# Altium schematic sheet TMC2160.SchDoc
size 381 x 241 mm
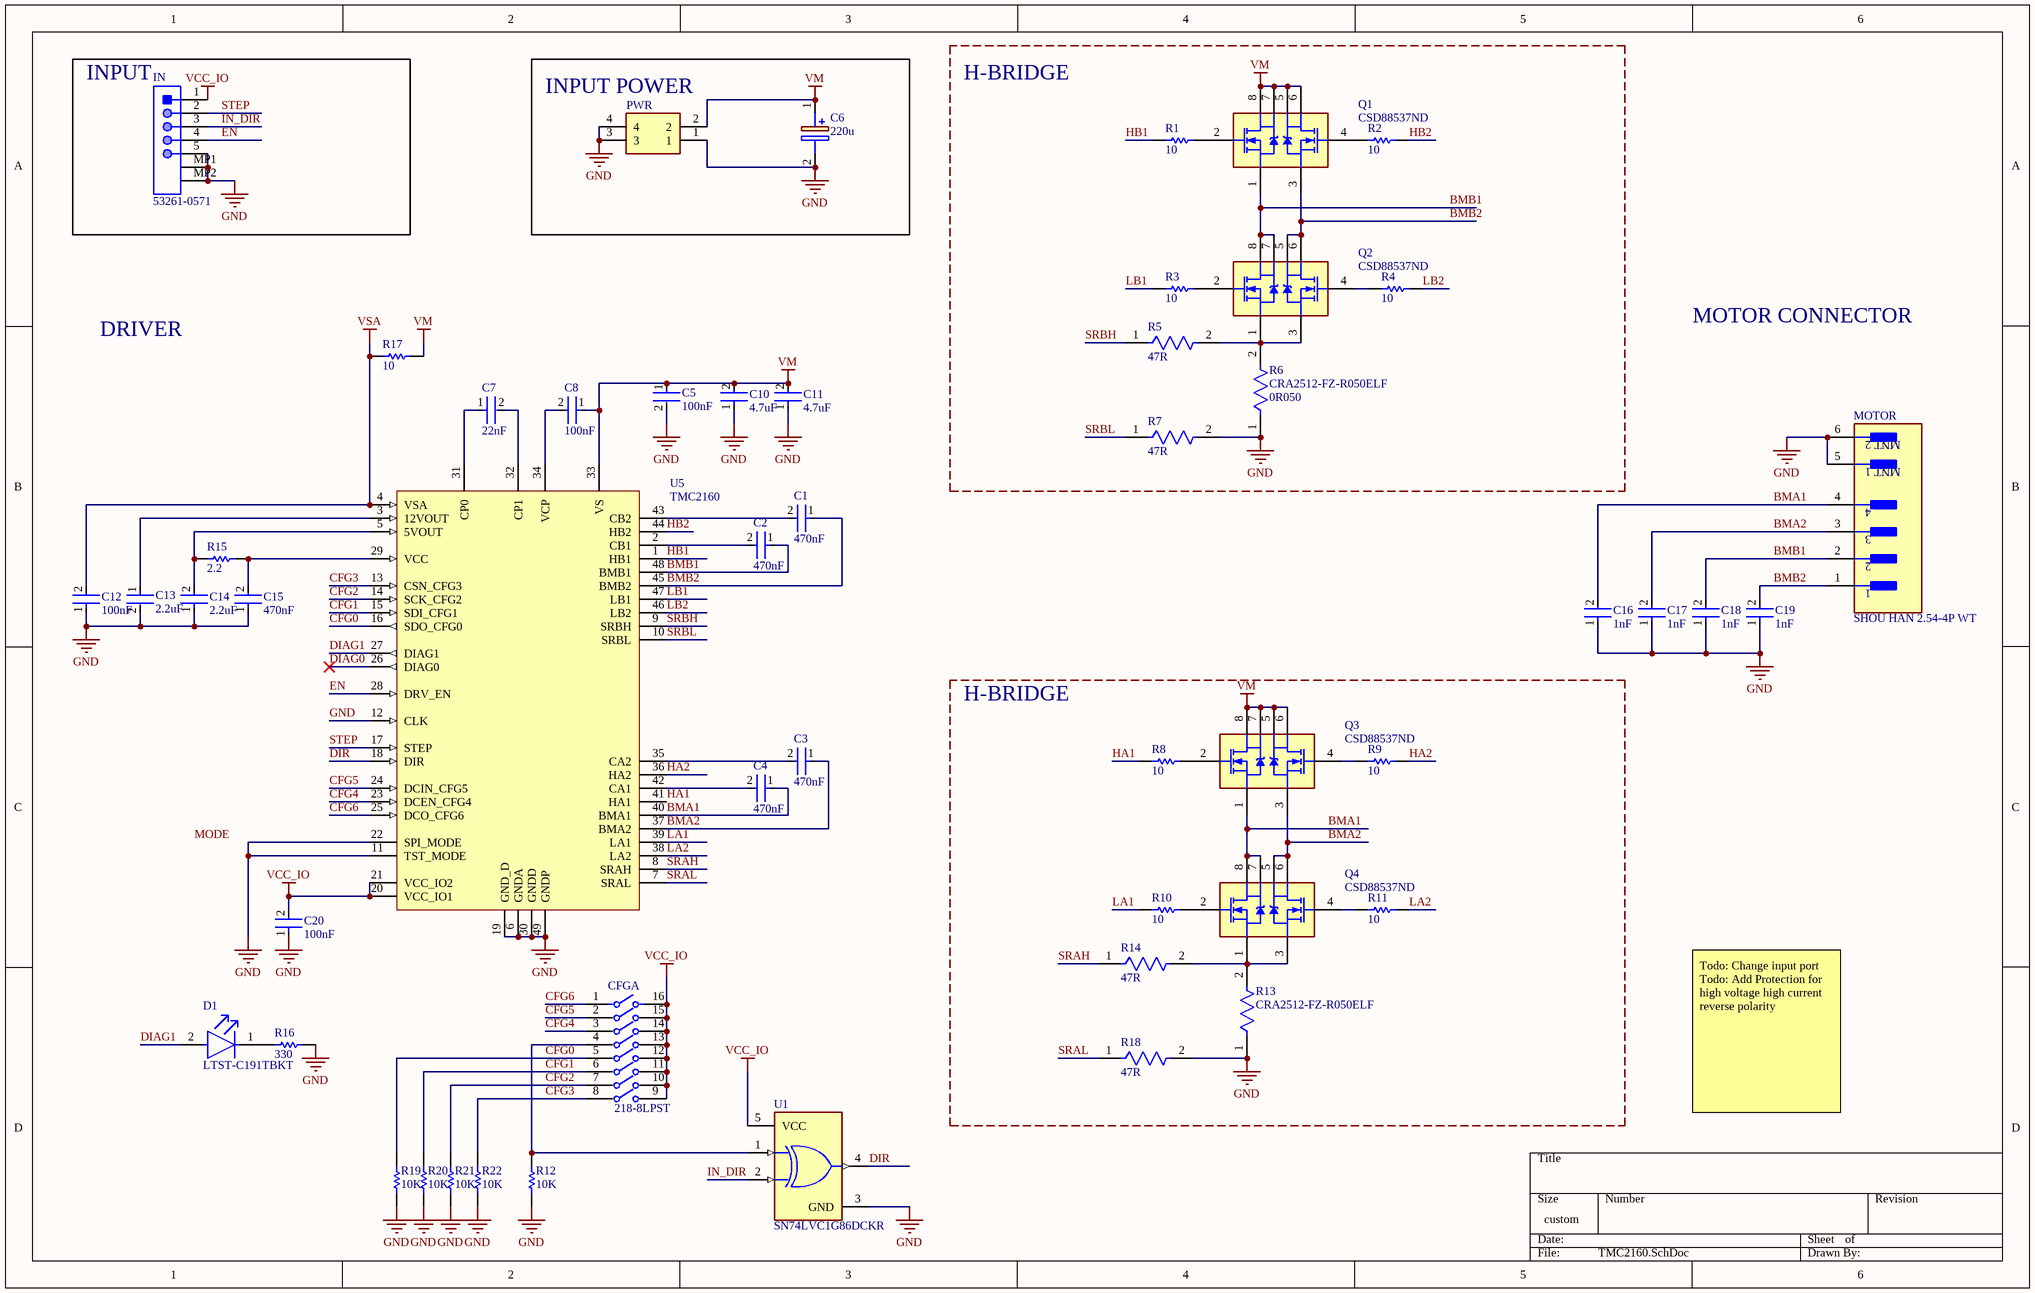
[diagram p0: TMC2160.SchDoc]

## Parts
C1  value 470nF  [FP-C1005-050-0_05-IPC_B]  (hidden comment: C1005X5R1V474K050BC)
C2  value 470nF  [FP-C1005-050-0_05-IPC_B]  (hidden comment: C1005X5R1V474K050BC)
C3  value 470nF  [FP-C1005-050-0_05-IPC_B]  (hidden comment: C1005X5R1V474K050BC)
C4  value 470nF  [FP-C1005-050-0_05-IPC_B]  (hidden comment: C1005X5R1V474K050BC)
C5  value 100nF  [FP-C1005-050-0_05-IPC_C]  (hidden comment: C1005X7R1H104K050BB)
C6  value 220u  [CAPAE1030X1050N]  (hidden comment: VZH221M1HTR-1010L)
C7  value 22nF  [FP-C1005-050-0_05-IPC_C]  (hidden comment: C1005X7R1H223K050BB)
C8  value 100nF  [FP-C1005-050-0_05-IPC_C]  (hidden comment: C1005X7R1H104K050BB)
C10  value 4.7uF  [FP-GRM21B-0_15-IPC_B]  (hidden comment: GRM21BR61H475KE51L)
C11  value 4.7uF  [FP-GRM21B-0_15-IPC_B]  (hidden comment: GRM21BR61H475KE51L)
C12  value 100nF  [FP-C1005-050-0_05-IPC_C]  (hidden comment: C1005X7R1H104K050BB)
C13  value 2.2uF  [FP-C1005-050-0_15-IPC_C]  (hidden comment: C1005X5R1V225K050BC)
C14  value 2.2uF  [FP-C1005-050-0_15-IPC_A]  (hidden comment: C1005X5R1V225K050BC)
C15  value 470nF  [FP-C1005-050-0_05-IPC_B]  (hidden comment: C1005X5R1V474K050BC)
C16  value 1nF  [FP-C1005-050-0_05-IPC_A]  (hidden comment: C1005X7R1H102K050BA)
C17  value 1nF  [FP-C1005-050-0_05-IPC_A]  (hidden comment: C1005X7R1H102K050BA)
C18  value 1nF  [FP-C1005-050-0_05-IPC_A]  (hidden comment: C1005X7R1H102K050BA)
C19  value 1nF  [FP-C1005-050-0_05-IPC_A]  (hidden comment: C1005X7R1H102K050BA)
C20  value 100nF  [FP-C1005-050-0_05-IPC_C]  (hidden comment: C1005X7R1H104K050BB)
CFG  218-8LPST  [FP-218-8LPST-MFG]  (value not drawn)  (parts A,B,C,D,E,F,G,H of 8)
D1  LTST-C191TBKT  [FP-LTST-C191TBKT-MFG]
IN  53261-0571  [MOLX-52361-0571-5_V]
MOTOR  SHOU HAN 2.54-4P WT  [A2501WF-04A]
PWR  SHOU HAN 2.54-2P WT  [A2501WF-02A]  (value not drawn)
Q1  CSD88537ND  [SOIC127P600X175-8N]
Q2  CSD88537ND  [SOIC127P600X175-8N]
Q3  CSD88537ND  [SOIC127P600X175-8N]
Q4  CSD88537ND  [SOIC127P600X175-8N]
R1  value 10  [RESC1005X40X25ML05T10]  (hidden comment: RC0402FR-0710RL)
R2  value 10  [RESC1005X40X25ML05T10]  (hidden comment: RC0402FR-0710RL)
R3  value 10  [RESC1005X40X25ML05T10]  (hidden comment: RC0402FR-0710RL)
R4  value 10  [RESC1005X40X25ML05T10]  (hidden comment: RC0402FR-0710RL)
R5  value 47R  [FP-ERJ2RK-IPC_C]  (hidden comment: ERJ-2RKF47R0X)
R6  CRA2512-FZ-R050ELF  value 0R050  [FP-CRA2512-IPC_A]
R7  value 47R  [FP-ERJ2RK-IPC_C]  (hidden comment: ERJ-2RKF47R0X)
R8  value 10  [RESC1005X40X25ML05T10]  (hidden comment: RC0402FR-0710RL)
R9  value 10  [RESC1005X40X25ML05T10]  (hidden comment: RC0402FR-0710RL)
R10  value 10  [RESC1005X40X25ML05T10]  (hidden comment: RC0402FR-0710RL)
R11  value 10  [RESC1005X40X25ML05T10]  (hidden comment: RC0402FR-0710RL)
R12  value 10K  [RESC1005X40X25LL05T10]  (hidden comment: RC0402FR-0710KL)
R13  CRA2512-FZ-R050ELF  [FP-CRA2512-IPC_A]
R14  value 47R  [FP-ERJ2RK-IPC_C]  (hidden comment: ERJ-2RKF47R0X)
R15  Resistance: 2.2  [RESC1005X40X25ML05T05]  (hidden comment: ERJ-2GEJ2R2X)
R16  value 330  [RESC1005X40X25LL05T10]  (hidden comment: RC0402FR-07330RL)
R17  value 10  [RESC1005X40X25ML05T10]  (hidden comment: RC0402FR-0710RL)
R18  value 47R  [FP-ERJ2RK-IPC_C]  (hidden comment: ERJ-2RKF47R0X)
R19  value 10K  [RESC1005X40X25LL05T10]  (hidden comment: RC0402FR-0710KL)
R20  value 10K  [RESC1005X40X25LL05T10]  (hidden comment: RC0402FR-0710KL)
R21  value 10K  [RESC1005X40X25LL05T10]  (hidden comment: RC0402FR-0710KL)
R22  value 10K  [RESC1005X40X25LL05T10]  (hidden comment: RC0402FR-0710KL)
U1  SN74LVC1G86DCKR  [FP-DCK0005A-MFG]
U5  TMC2160  [TSQFP-48]

## Blocks framed on the sheet
INPUT: IN
INPUT POWER: C6 PWR
H-BRIDGE: Q1 Q2 R1-R7
H-BRIDGE: Q3 Q4 R8-R11 R13 R14 R18

## Nets
GND: C5.2 C6.2(-) C10.1 C11.1 C12.1 C13.2 C14.1 C15.1 C16.1 C17.1 C18.1 C19.1 C20.1 IN.5 IN.MP1 IN.MP2 MOTOR.5(MNT_1) MOTOR.6(MNT_2) PWR.1 PWR.3 PWR.4 R6.1 R7.2 R12.1 R13.1 R16.1 R18.2 R19.1 R20.1 R21.1 R22.1 U1.3(GND) U5.6(GNDA) U5.11(TST_MODE) U5.12(CLK) U5.19(GND_D) U5.22(SPI_MODE) U5.30(GNDD) U5.49(GNDP)
VCC_IO: C20.2 CFG.9 CFG.10 CFG.11 CFG.12 CFG.13 CFG.14 CFG.15 CFG.16 IN.1 U1.5(VCC) U5.20(VCC_IO1) U5.21(VCC_IO2)
VM: C5.1 C6.1(+) C8.1 C10.2 C11.2 PWR.2 Q1.5(D2_1) Q1.6(D2_2) Q1.7(D1_1) Q1.8(D1_2) Q3.5(D2_1) Q3.6(D2_2) Q3.7(D1_1) Q3.8(D1_2) R17.1 U5.33(VS)
VSA: C12.2 R17.2 U5.4(VSA)
BMA1: C4.1 C16.2 MOTOR.4 Q3.1(S1) Q4.7(D1_1) Q4.8(D1_2) U5.40(BMA1)
BMA2: C3.1 C17.2 MOTOR.3 Q3.3(S2) Q4.5(D2_1) Q4.6(D2_2) U5.37(BMA2)
BMB1: C2.1 C18.2 MOTOR.2 Q1.1(S1) Q2.7(D1_1) Q2.8(D1_2) U5.48(BMB1)
BMB2: C1.1 C19.2 MOTOR.1 Q1.3(S2) Q2.5(D2_1) Q2.6(D2_2) U5.45(BMB2)
CFG0: CFG.5 R19.2 U5.16(SDO_CFG0)
CFG1: CFG.6 R20.2 U5.15(SDI_CFG1)
CFG2: CFG.7 R21.2 U5.14(SCK_CFG2)
CFG3: CFG.8 R22.2 U5.13(CSN_CFG3)
CFG4: CFG.3 U5.23(DCEN_CFG4)
CFG5: CFG.2 U5.24(DCIN_CFG5)
CFG6: CFG.1 U5.25(DCO_CFG6)
DIAG0: U5.26(DIAG0)
DIAG1: D1.2(A) U5.27(DIAG1)
DIR: U1.4(Y) U5.18(DIR)
EN: IN.4 U5.28(DRV_EN)
HA1: R8.2 U5.41(HA1)
HA2: R9.1 U5.36(HA2)
HB1: R1.2 U5.1(HB1)
HB2: R2.1 U5.44(HB2)
IN_DIR: IN.3 U1.2(B)
LA1: R10.2 U5.39(LA1)
LA2: R11.1 U5.38(LA2)
LB1: R3.2 U5.47(LB1)
LB2: R4.1 U5.46(LB2)
SRAH: R14.1 U5.8(SRAH)
SRAL: R18.1 U5.7(SRAL)
SRBH: R5.1 U5.9(SRBH)
SRBL: R7.1 U5.10(SRBL)
STEP: IN.2 U5.17(STEP)
NetC1_2: C1.2 U5.43(CB2)
NetC2_2: C2.2 U5.2(CB1)
NetC3_2: C3.2 U5.35(CA2)
NetC4_2: C4.2 U5.42(CA1)
NetC7_1: C7.1 U5.31(CP0)
NetC7_2: C7.2 U5.32(CP1)
NetC8_2: C8.2 U5.34(VCP)
NetC13_1: C13.1 U5.3(12VOUT)
NetC14_2: C14.2 R15.2 U5.5(5VOUT)
NetC15_2: C15.2 R15.1 U5.29(VCC)
NetCFG_4: CFG.4 R12.2 U1.1(A)
NetD1_1: D1.1(C) R16.2
NetQ1_2: Q1.2(G1) R1.1
NetQ1_4: Q1.4(G2) R2.2
NetQ2_1: Q2.1(S1) Q2.3(S2) R5.2 R6.2
NetQ2_2: Q2.2(G1) R3.1
NetQ2_4: Q2.4(G2) R4.2
NetQ3_2: Q3.2(G1) R8.1
NetQ3_4: Q3.4(G2) R9.2
NetQ4_1: Q4.1(S1) Q4.3(S2) R13.2 R14.2
NetQ4_2: Q4.2(G1) R10.1
NetQ4_4: Q4.4(G2) R11.2

## Notes on the sheet
- DRIVER
- MOTOR CONNECTOR
- Todo: Change input port
  Todo: Add Protection for high voltage high current reverse polarity
- Labels drawn without touching a wire or pin: MODE

## Library data of the parts
C1-C4 C15 = CMP-08246-003870-1: Multilayer Ceramic Capacitors 470nF ±10% 35V X5R SMD 0402; Voltage Rating: 35V; Package Quantity: 10000; RoHS Compliant: Yes; Height: 0.5mm; Termination: SMD/SMT; Tolerance: 10%; Length: 0.039inch; Dielectric Material: Ceramic; Dielectric: X5R; Min Operating Temperature: -55°C; Case Code (Imperial): 0402; Mount: Surface Mount; Max Operating Temperature: 85°C; Voltage Rating (DC): 35V; Packaging: Tape and Reel; Width: 0.02inch; Case/Package: 0402; Series: C; Weight: 2.3E-05oz; Case Code (Metric): 1005; Lead Free: Lead Free; Thickness: 0.022inch
C5 C8 C12 C20 = CMP-2000-05393-2: Multilayer Ceramic Capacitors 100nF ±10% 50V X7R SMD 0402; Voltage: 50V; Dielectric Material: Ceramic; Min Operating Temperature: -55°C; Depth: 0.5mm; Radiation Hardening: No; RoHS Compliant: Yes; Voltage Rating (DC): 50V; Lead Free: Lead Free; Resistor Type: Ceramic; Height: 0.5mm; Dielectric: X7R; Thickness: 0.022inch; Case/Package: 0402; Case Code (Metric): 1005; Termination: SMD/SMT; Packaging: Tape and Reel; Max Operating Temperature: 125°C; Mount: Surface Mount; Package Quantity: 1; Width: 0.02inch; Weight: 2.3E-05oz; Voltage Rating: 50V; Tolerance: 10%; Construction: Flat; Case Code (Imperial): 0402; Length: 1mm; REACH SVHC: No SVHC; Series: C
C6 = VZH221M1HTR-1010L: Capacitor Polarised; Manufacturer_Name: Lelon; Datasheet Link: https://www.mouser.co.uk/datasheet/2/231/151002387394-1222329.pdf; Height: 10.5mm; Manufacturer_Part_Number: VZH221M1HTR-1010L
C7 = CMP-08246-004483-1: Multilayer Ceramic Capacitors 22nF ±10% 50V X7R SMD 0402; Radiation Hardening: No; Voltage Rating: 50V; Case Code (Imperial): 0402; Depth: 0.5mm; REACH SVHC: No SVHC; Dielectric Material: Ceramic; Package Quantity: 1; Length: 1mm; Case/Package: 0402; Voltage Rating (DC): 50V; Tolerance: 10%; Resistor Type: Ceramic; Thickness: 0.022inch; Weight: 2.3E-05oz; Min Operating Temperature: -55°C; Dielectric: X7R; RoHS Compliant: Yes; Number of Pins: 2; Termination: SMD/SMT; Mount: Surface Mount; Series: C; Height: 0.5mm; Max Operating Temperature: 125°C; Packaging: Tape and Reel; Case Code (Metric): 1005; Width: 0.02inch; Construction: Flat; Lead Free: Lead Free
C10 C11 = CMP-06035-059131-1: Chip Multilayer Ceramic Capacitors for General Purpose, 0805, 4.7uF, X5R, 15%, 10%, 50V; Case Code (Metric): 2012; Height: 1.25mm; Width: 0.049inch; Packaging: Tape and Reel; Mount: Surface Mount; Case/Package: 0805; REACH SVHC: No SVHC; Case Code (Imperial): 0805; Dielectric: X5R; Thickness: 0.055inch; Voltage Rating: 50V; Material: Ceramic; Depth: 1.25mm; Min Operating Temperature: -55°C; Lead Free: Lead Free; Max Operating Temperature: 85°C; Tolerance: 10%; Length: 2mm; Voltage Rating (DC): 50V
C13 C14 = CMP-08246-007153-1: CAP CER 2.2UF 35V X5R 0402; Dielectric Material: Ceramic; Tolerance: 10%; Package Quantity: 1; Voltage Rating: 35V; Case Code (Metric): 1005; Width: 0.5mm; RoHS Compliant: Yes; Min Operating Temperature: -55°C; Packaging: Tape and Reel; Voltage Rating (DC): 35V; Thickness: 0.022inch; REACH SVHC: No SVHC; Max Operating Temperature: 85°C; Length: 1mm; Case Code (Imperial): 0402; Resistor Type: Ceramic; Lead Free: Lead Free; Series: C; Termination: SMD/SMT; Height: 0.5mm; Mount: Surface Mount; Case/Package: 0402; Weight: 2.3E-05oz; Dielectric: X5R; Depth: 0.5mm
C16-C19 = CMP-08246-005438-1: Multilayer Ceramic Capacitors 1nF ±10% 50V X7R SMD 0402; Tolerance: 10%; Mount: Surface Mount; Series: C; Width: 0.02inch; Packaging: Tape and Reel; Voltage: 50V; Case Code (Metric): 1005; RoHS Compliant: Yes; Package Quantity: 1; Voltage Rating (DC): 50V; Depth: 0.5mm; Radiation Hardening: No; Height: 0.5mm; Voltage Rating: 50V; Thickness: 0.022inch; Dielectric: X7R; Length: 1mm; Lead Free: Lead Free; Max Operating Temperature: 125°C; Termination: SMD/SMT; Min Operating Temperature: -55°C; REACH SVHC: No SVHC; Case Code (Imperial): 0402; Weight: 2.3E-05oz; Dielectric Material: Ceramic; Resistor Type: Ceramic; Case/Package: 0402; Construction: Flat
CFG = CMP-07018-000007-1: SWITCH SLIDE DIP SPST 25MA 24V; Number of Positions: 8; Pitch: 0.05inch; Actuator Type: Slide (Standard); Electrical Life: 1000Cycles; Washable: Yes; Contact Resistance: 100mR; Radiation Hardening: No; Packaging: Rail/Tube; Length: 0.446inch; Depth: 8.44mm; Max Voltage Rating (DC): 24V; Lead Free: Lead Free; Mount: Surface Mount; RoHS Compliant: Yes; Series: 218; Max Operating Temperature: 85°C; Termination: Gull Wing; Voltage Rating (DC): 24V; Current Rating: 25mA; Contact Plating: Gold; Min Operating Temperature: -55°C; Terminal Pitch: 1.27mm; Contact Material: Copper; Throw Configuration: SPST; Orientation: Straight; Max Current Rating: 25mA; Height: 2.65mm; Package Quantity: 40
D1 = CMP-22017-000008-1: LED BLUE CLEAR CHIP SMD; Lens Color: Colorless; Dominant Wavelength: 475nm; Forward Current: 20mA; Wavelength: 468nm; Viewing Angle: 130°; Power Dissipation: 76mW; Luminous Intensity: 180mcd; Reverse Voltage: 5V; Number of Elements: 1; Lens Style: Diffused; Forward Voltage: 3.8V; Max Power Dissipation: 75mW; Case Code (Metric): 1608; Packaging: Tape and Reel; Case/Package: 0603; Depth: 1.6mm; Mount: Surface Mount; Lead Free: Lead Free; Min Operating Temperature: -20°C; Lens Transparency: Clear; Illumination Color: Blue; Height: 0.55mm; Test Current: 20mA; Case Code (Imperial): 0603; Max Operating Temperature: 80°C; Number of Pins: 2; Length: 0.8mm; Radiation Hardening: No; Package Quantity: 1; Number of LEDs: 1; Width: 0.8mm; Color: Blue; Value: Blue
IN = CMP-2000-05249-1: Male Header, Pitch 1.25 mm, 1 x 5 Position, Height 3.4 mm, RoHS, Tape and Reel; Brand: Molex; Mounting Angle: Right; Number of Positions: 5; Voltage Rating: 125V; Current Rating: 1A; Pitch: 1.25mm; Datasheet Version: Rev. D, 04/2004; Housing Material: Thermoplastic; Series: 53261; RoHS: Details; Product Category: Headers&WireHousings; Datasheet URL: http://datasheet.octopart.com/532610571-Molex-datasheet-8343080.pdf; Manufacturer URL: http://www.molex.com/; Contact Material: PhosphorBronze; Tradename: PicoBlade; Number of Rows: 1; Product Type: Headers; Manufacturer: Molex; Type: Shrouded; Termination Style: SMD; Mounting Style: SMD/SMT; Factory Pack Quantity: 1000; Contact Plating: Tin; Packaging: Reel; Number of Positions / Contacts: 5
MOTOR = CMP-17439-000072-1: CONN HEADER SMD R/A 4POS 2.5MM; Number of Positions: 4; Max Current Rating: 3A; Max Voltage Rating (AC): 250V; Connector Type: Male Pin; Contact Resistance: 20mR; Gender: Male; Pitch: 0.098inch; Max Operating Temperature: 85°C; Contact Plating: Tin; Housing Material: Polyamide; Housing Color: Beige; Depth: 10mm; Series: XH; Package Quantity: 1; Length: 15mm; Contact Material: Copper Alloy; Min Operating Temperature: -25°C; REACH SVHC: No SVHC; Orientation: Right Angle; Number of Rows: 1; Contact Type: Male Pin; Color: Natural; Lead Free: Lead Free; Termination: Solder; Mount: Surface Mount; Number of Contacts: 4; Packaging: Tape and Reel
PWR = 1778764: Connector; Manufacturer_Name: Phoenix Contact; Datasheet Link: http://www.phoenixcontact.com/de/produkte/1778764/pdf; Height: 5.1mm; Manufacturer_Part_Number: 1778764; Mouser Part Number: 651-1778764; Mouser Price/Stock: https://www.mouser.co.uk/ProductDetail/Phoenix-Contact/1778764?qs=i0qWf6NAoDsxsSJGIXIgDA%3D%3D; Arrow Part Number: 1778764; Arrow Price/Stock: https://www.arrow.com/en/products/1778764/phoenix-contact?utm_currency=USD&region=nac
Q1-Q4 = CSD88537ND: MOSFET (N-Channel); Manufacturer_Name: Texas Instruments; Datasheet Link: http://www.ti.com/lit/gpn/csd88537nd; Height: 1.75mm; Manufacturer_Part_Number: CSD88537ND; Mouser Part Number: 595-CSD88537ND; Mouser Price/Stock: https://www.mouser.co.uk/ProductDetail/Texas-Instruments/CSD88537ND?qs=7wMBv%2Ftbz9KkQ3rfcHocDA%3D%3D; Arrow Part Number: CSD88537ND; Arrow Price/Stock: https://www.arrow.com/en/products/csd88537nd/texas-instruments?region=nac
R1-R4 R8-R11 R17 = CMP-2002-07344-1: Part Number: RC0402FR-07100RL; Manufacturer: Yageo / Phycomp
R5 R7 R14 R18 = CMP-1011-00360-3: RES SMD 47 OHM 1% 1/10W 0402; Power Rating: 100mW; Temperature Coefficient: 100ppm/°C; Voltage Rating (DC): 50V; Case Code (Imperial): 0402; Width: 0.02inch; Height: 0.35mm; Features: Automotive AEC-Q200; Case/Package: 0402; RoHS Compliant: Yes; Lead Free: Lead Free; Case Code (Metric): 1005; Technology: THICK FILM; Termination: SMD/SMT; Tolerance: 1%; Resistance Tolerance: 1%; Max Operating Temperature: 155°C; Construction: Rectangular; Mount: Surface Mount; Min Operating Temperature: -55°C; Max Power Dissipation: 100mW; Number of Terminations: 2; Military Standard: Not; REACH SVHC: No SVHC; Resistor Type: Thick Film; Contact Plating: Tin; Package Quantity: 1; Series: ERJ; Packaging: Tape and Reel; Voltage Rating: 50V; Weight: 2.8E-05oz; Length: 1mm; Number of Pins: 2; Depth: 0.5mm
R6 R13 = CMP-07231-007405-1: RES 0.05 OHM 1% 3W 2512
R12 R19-R22 = CMP-2002-07353-1: Manufacturer: Yageo / Phycomp; Part Number: RC0402FR-0710KL
R15 = CMP-1011-00010-2: Manufacturer: Panasonic; Part Number: ERJ-2GEJ2R2X
R16 = CMP-2002-07613-1: Manufacturer: Yageo / Phycomp; Part Number: RC0402FR-07330RL
U1 = CMP-0859-00438-4: IC GATE XOR 1CH 2-INP SC70-5; Manufacturer: Texas Instruments; Max Supply Voltage: 5.5V; Standoff Height: 0mm; Max Junction Temp: +150°C; Number Of Inputs: 2; Nominal Supply Current: 15uA; Number Of Outputs: 1; Propagation Delay: 5ns; Min Supply Voltage: 1.65V; ComponentLink2Description: Datasheet; Lead Free: Yes; Temperature Range High: +125°C; Temperature Range Low: -40°C; RoHS: TRUE; Category: IC; Octopart: https://octopart.com/sn74lvc1g86dckr-texas+instruments-465565; Temperature: -40°C to +125°C; Digikey Description: IC GATE XOR 1CH 2-INP SC70-5; Ambient Temperature Range Low: -40°C; ComponentLink2URL: https://www.ti.com/lit/ds/symlink/sn74lvc1g86.pdf; Device Class L3: Logic Gates; Device Class L1: Integrated Circuits (ICs); Device Class L2: Logic ICs; Automotive: No; Logic Function Desc: XOR; Ambient Temperature Range High: +125°C; Number Of Circuits: 1; Manufacturer Part Number: SN74LVC1G86DCKR; Mouser Description: Logic Gates 2 Input; Height: 1.1mm; Package: DCK0005A